# Altium schematic sheet Raspberry.SchDoc
size A4
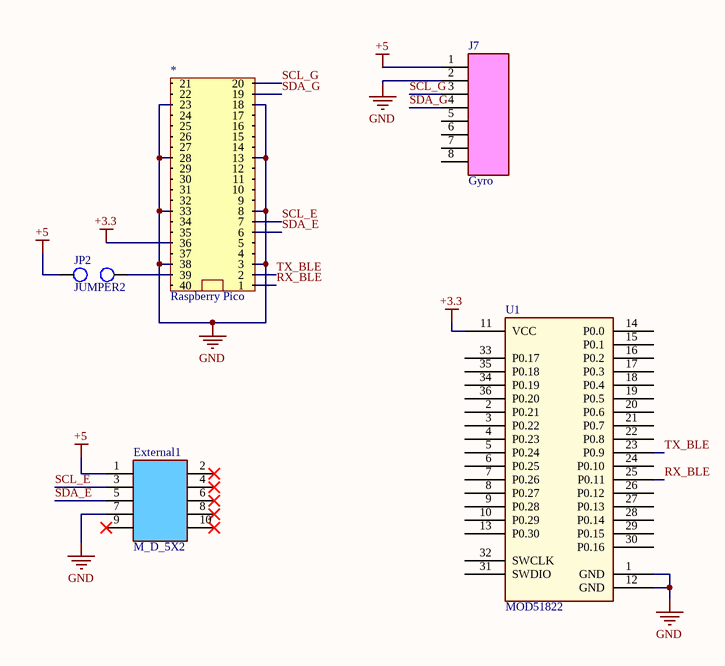
[diagram p0: Raspberry.SchDoc]

## Parts
*  Raspberry Pico  [Raspberry Pico]
External1  Type: M_D_5X2  [BARRETTE_5X2_M_D]  (hidden comment: BARRETTE_5 CONTACTS_2 RANGEES_MALE_DROITE)
J7  Type: Gyro  [BARRETTE_8_F_D]  (hidden comment: BARRETTE_8 CONTACTS_1 RANGEE_FEMELLE_DROITE)
JP2  JUMPER2  [BARRETTE_2_M_D]
U1  MOD51822  [MOD51822]

## Nets
+3.3: *.36 U1.11(VCC)
+5: External1.1 J7.1 JP2.1
GND: *.3 *.8 *.13 *.18 *.23 *.28 *.33 *.38 External1.7 J7.2 U1.1(GND) U1.12(GND)
RX_BLE: *.1 U1.25(P0.11)
SCL_E: *.7 External1.3
SCL_G: *.20 J7.3
SDA_E: *.6 External1.5
SDA_G: *.19 J7.4
TX_BLE: *.2 U1.23(P0.9)
Net*_39: *.39 JP2.2

Not connected (* = marked no-connect by the designer): * 4 5 9 10 11 12 14 15 16 17 21 22 24 25 26 27 29 30 31 32 34 35 37 40; External1 2* 4* 6* 8* 9* 10*; J7 5 6 7 8; U1 2(P0.21) 3(P0.22) 4(P0.23) 5(P0.24) 6(P0.25) 7(P0.26) 8(P0.27) 9(P0.28) 10(P0.29) 13(P0.30) 14(P0.0) 15(P0.1) 16(P0.2) 17(P0.3) 18(P0.4) 19(P0.5) 20(P0.6) 21(P0.7) 22(P0.8) 24(P0.10) 26(P0.12) 27(P0.13) 28(P0.14) 29(P0.15) 30(P0.16) 31(SWDIO) 32(SWCLK) 33(P0.17) 34(P0.19) 35(P0.18) 36(P0.20)

## Library data of the parts
External1 = BARRETTE_5 CONTACTS_2 RANGEES_MALE_DROITE: BARRETTE 5 CONTACTS 2 RANGEES MALE DROITE
JP2 = JUMPER2: BARRETTE 2 CONTACTS 1 RANGEE MALE DROITE; Type: JUMPER2